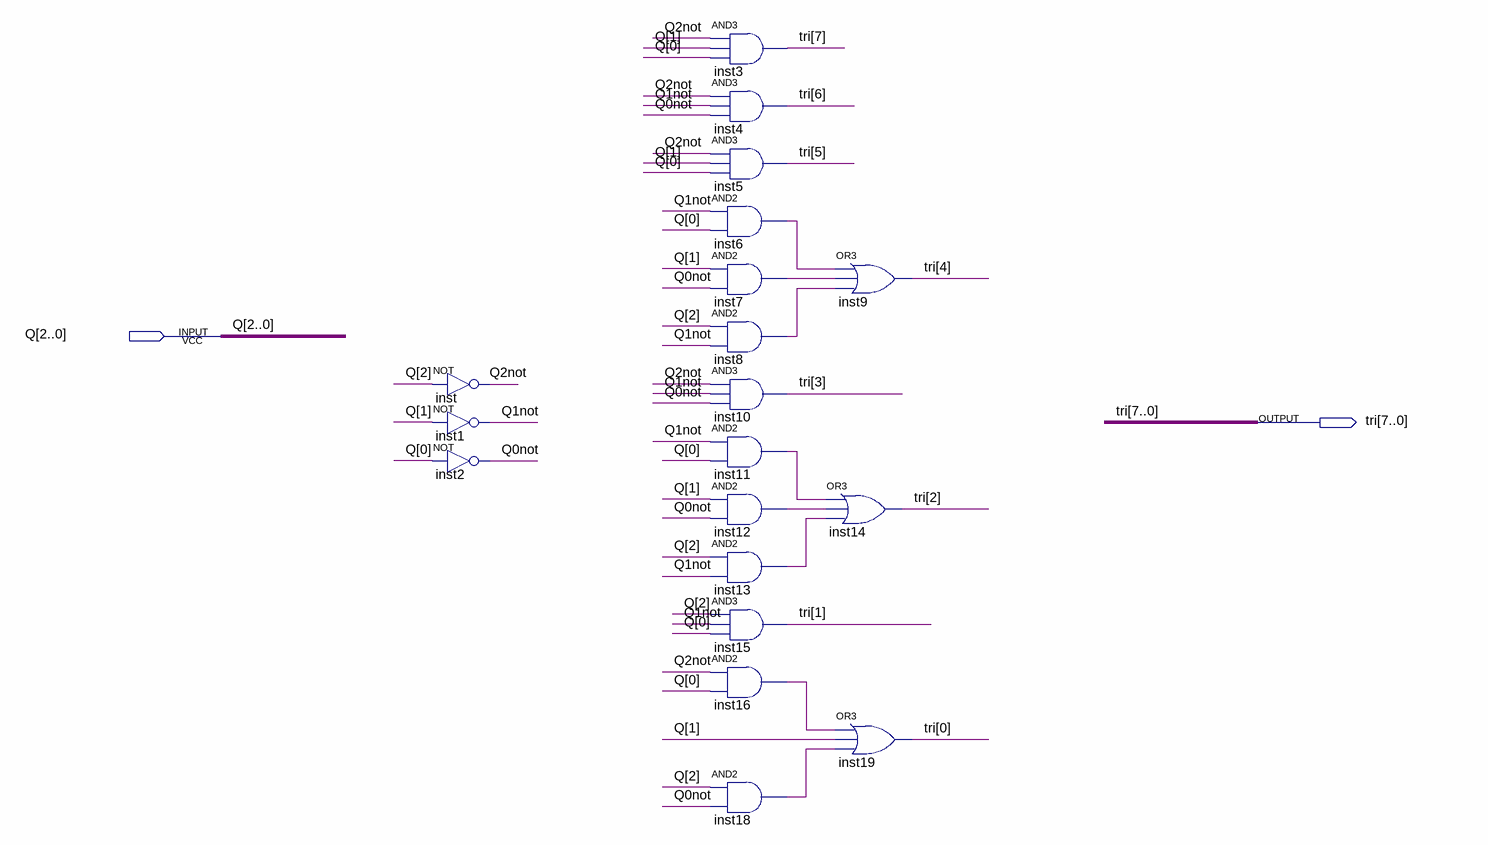
[diagram p0: schematic sheet]
// Quartus schematic Ctrl_tri_state.bdf as structural Verilog: 19 symbols, 2 pins
module Ctrl_tri_state (
  input  [2:0] Q,
  output [7:0] \tri 
);

  wire inst6_out, inst7_out, inst8_out, inst11_out, inst12_out, inst13_out, inst16_out, inst18_out, Q0not,
       Q1not, Q2not;

  not inst (Q2not, Q[2]);
  not inst1 (Q1not, Q[1]);
  not inst2 (Q0not, Q[0]);
  and inst3 (\tri [7], Q2not, Q[1], Q[0]);
  and inst4 (\tri [6], Q2not, Q1not, Q0not);
  and inst5 (\tri [5], Q2not, Q[1], Q[0]);
  and inst6 (inst6_out, Q1not, Q[0]);
  and inst7 (inst7_out, Q[1], Q0not);
  and inst8 (inst8_out, Q[2], Q1not);
  and inst10 (\tri [3], Q2not, Q1not, Q0not);
  and inst11 (inst11_out, Q1not, Q[0]);
  and inst12 (inst12_out, Q[1], Q0not);
  and inst13 (inst13_out, Q[2], Q1not);
  and inst15 (\tri [1], Q[2], Q1not, Q[0]);
  and inst16 (inst16_out, Q2not, Q[0]);
  and inst18 (inst18_out, Q[2], Q0not);
  or inst9 (\tri [4], inst6_out, inst7_out, inst8_out);
  or inst14 (\tri [2], inst11_out, inst12_out, inst13_out);
  or inst19 (\tri [0], inst16_out, Q[1], inst18_out);
endmodule
